# EAGLE schematic Relay (EAGLE 7.2.0)
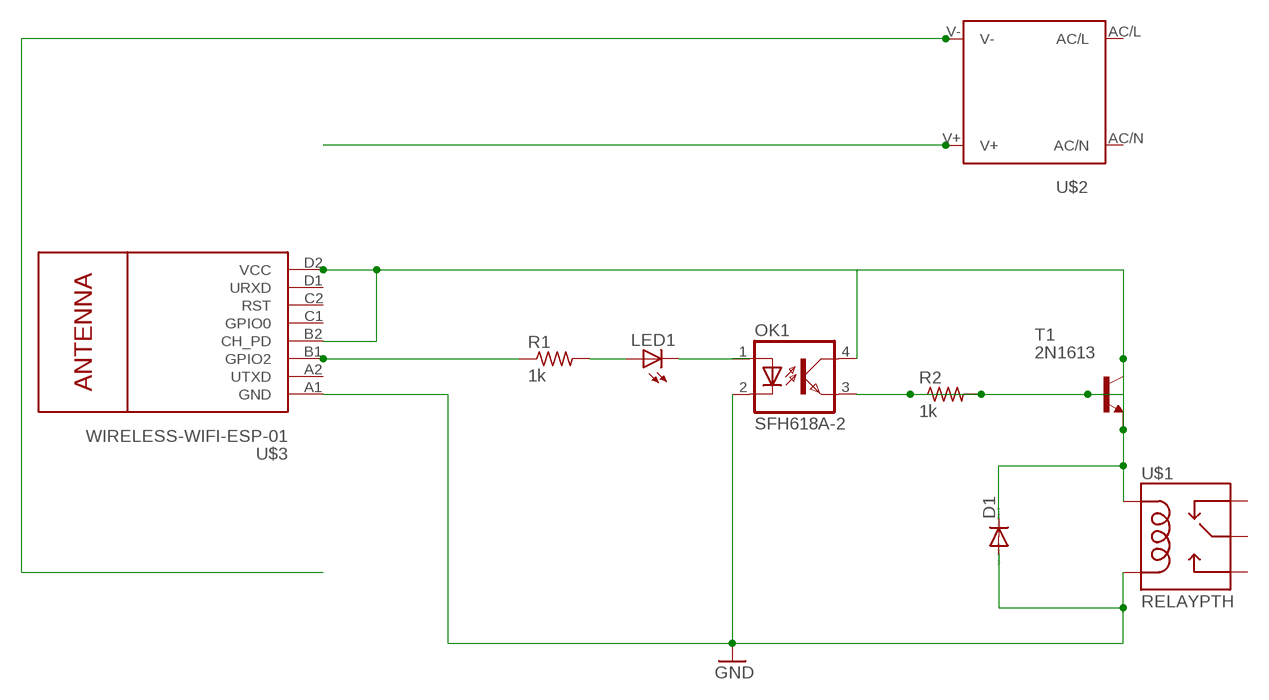
[diagram p0: schematic, sheet 1]

## Parts
D1  DIODE-D-2.5  [D-2.5]
LED1  LED3MM  [LED3MM]
OK1  SFH618A-2  [DIP4]
R1  1k  R-US_R2012  [R2012]
R2  1k  R-US_R2012  [R2012]
T1  2N1613  [TO5]
U$1  RELAYPTH  [SRD-05VDC-SL-C]
U$2  IRM_15/20  [IRM_15/20]
U$3  WIRELESS-WIFI-ESP-01  [WIRELESS-WIFI-ESP-01]

## Nets
GND: D1.A OK1.2(C) U$1.COIL0 U$3.A1(GND)
N$1: U$2.V+
N$2: R1.1 U$3.B1(GPIO2)
N$3: LED1.A R1.2
N$5: LED1.K(C)
N$6: U$2.V-
N$7: D1.C OK1.3(EMIT) OK1.4(COL) R2.1 R2.2 T1.1(E) T1.2(B) T1.3(C) U$1.COIL1 U$3.B2(CH_PD) U$3.D2(VCC)
Unconnected: OK1.1(A) U$1.SWCLOSED(SWCLOSE) U$1.SWCOMMON U$1.SWOPEN U$2.AC/L U$2.AC/N U$3.A2(UTXD) U$3.C1(GPIO0) U$3.C2(RST) U$3.D1(URXD)

## Library data of the parts
D1 = diode:DIODE-: DIODE
LED1 = led:LED: LED OSRAM: - CHIPLED LG R971, LG N971, LY N971, LG Q971, LY Q971, LO R971, LY R971 LH N974, LH R974 LS Q976, LO Q976, LY Q976 LO Q996 - Hyper CHIPLED LW Q18S LB Q993, LB Q99A, LB R99A - SideLED LS A670, LO A670, LY A670, LG A670, LP A670 LB A673, LV A673, LT A673, LW A673 LH A674 LY A675 LS A676, LA A676, LO A676, LY A676, LW A676 LS A679, LY A679, LG A679 - Hyper Micro SIDELED® LS Y876, LA Y876, LO Y876, LY Y876 LT Y87S - SmartLED LW L88C, LW L88S LB L89C, LB L89S, LG L890 LS L89K, LO L89K, LY L89K LS L896, LA L896, LO L896, LY L896 - TOPLED LS T670, LO T670, LY T670, LG T670, LP T670 LSG T670, LSP T670, LSY T670, LOP T670, LYG T670 LG T671, LOG T671, LSG T671 LB T673, LV T673, LT T673, LW T673 LH T674 LS T676, LA T676, LO T676, LY T676, LB T676, LH T676, LSB T676, LW T676 LB T67C, LV T67C, LT T67C, LS T67K, LO T67K, LY T67K, LW E67C LS E67B, LA E67B, LO E67B, LY E67B, LB E67C, LV E67C, LT E67C LW T67C LS T679, LY T679, LG T679 LS T770, LO T770, LY T770, LG T770, LP T770 LB T773, LV T773, LT T773, LW T773 LH T774 LS E675, LA E675, LY E675, LS T675 LS T776, LA T776, LO T776, LY T776, LB T776 LHGB T686 LT T68C, LB T68C - Hyper Mini TOPLED® LB M676 - Mini TOPLED Santana® LG M470 LS M47K, LO M47K, LY M47K Source: http://www.osram.convergy.de LUXEON: - LUMILED® LXK2-PW12-R00, LXK2-PW12-S00, LXK2-PW14-U00, LXK2-PW14-V00 LXK2-PM12-R00, LXK2-PM12-S00, LXK2-PM14-U00 LXK2-PE12-Q00, LXK2-PE12-R00, LXK2-PE12-S00, LXK2-PE14-T00, LXK2-PE14-U00 LXK2-PB12-K00, LXK2-PB12-L00, LXK2-PB12-M00, LXK2-PB14-N00, LXK2-PB14-P00, LXK2-PB14-Q00 LXK2-PR12-L00, LXK2-PR12-M00, LXK2-PR14-Q00, LXK2-PR14-R00 LXK2-PD12-Q00, LXK2-PD12-R00, LXK2-PD12-S00 LXK2-PH12-R00, LXK2-PH12-S00 LXK2-PL12-P00, LXK2-PL12-Q00, LXK2-PL12-R00 Source: www.luxeon.com KINGBRIGHT: KA-3528ASYC Source: www.kingbright.com
OK1 = optocoupler:SFH618?*: Optocoupler, Phototransistor Output, Low Input Current Source: Data sheet <http://www.vishay.com/docs/83673/sfh618.pdf>; MF: VISHAY/TELEFUNKEN; MPN: SFH618A-2; OC_FARNELL: 6424855; OC_NEWARK: 21H7744
R1 R2 = resistor:R-US_: RESISTOR, American symbol
T1 = transistor:2N1613: NPN TRANSISTOR
U$1 = SRD-05VDC-SL-C:RELAY: SPDT relay (COM-00101)
U$2 = meanwell_irm_v4:IRM_15/20: Meanwell Onboard Power Supply IRM 15 or IRM 20 (pin compatible) IRM 15 Vout [V] Imax [A] Pmax [W] Eff [%] 3.3 3.5 11.55 74 5 3 15 78 12 1.25 15 82 15 1 15 82 24 0.63 15.12 83 IRM 20 Vout [V] Imax [A] Pmax [W] Eff [%] 3.3 4.5 14.85 76 5 4 20 79 12 1.8 21.6 84 15 1.4 21.6 84 24 0.9 21.6 85
U$3 = diy-modules:WIRELESS-WIFI-ESP-01: Wireless Wi-Fi ESP-01 Module based on ESP8266 chip